# EAGLE design drive (EAGLE 9.1.3)
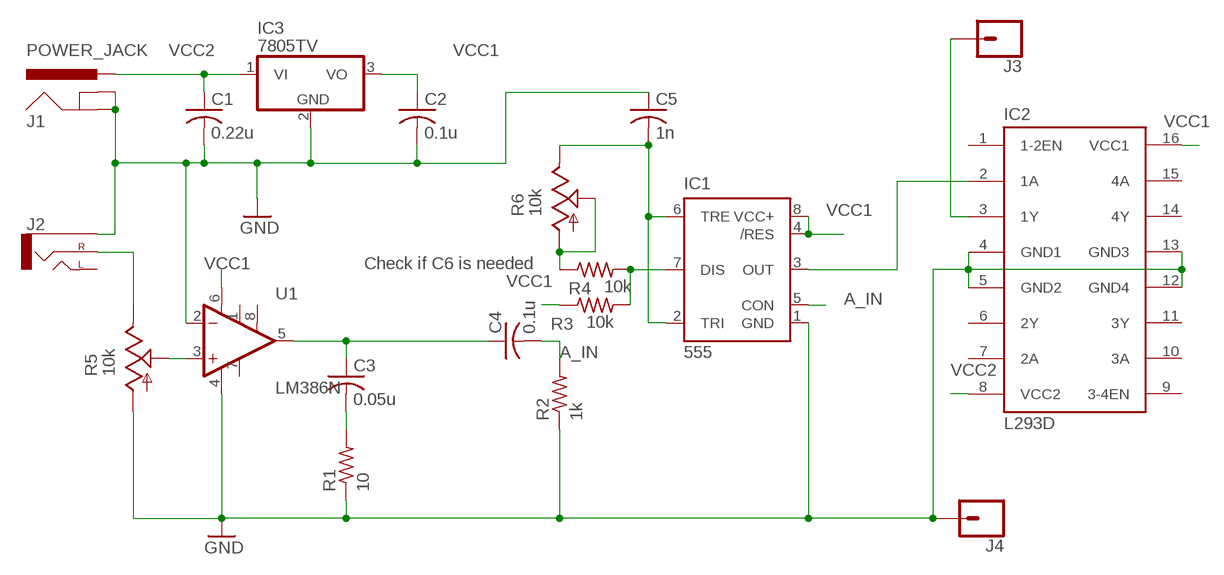
[diagram p0: schematic, sheet 1]

## Parts
C1  0.22u  C-US025-030X050  [C025-030X050]
C2  0.1u  C-US025-030X050  [C025-030X050]
C3  0.05u  C-US025-030X050  [C025-030X050]
C4  0.1u  C-US025-030X050  [C025-030X050]
C5  1n  C-US025-030X050  [C025-030X050]
IC1  555  555P  [DIP08]
IC2  L293D  [DIL16]
IC3  7805TV  [TO220V]
J1  POWER_JACK  [POWER_JACK_PTH]
J2  AUDIO_JACK_2.5MMSPECIAL_POGO_PINS  [STEREOJACK2.5MM_SPECIAL_POGOPINS]
J3  CONN_01SMTSO-256-ET-0.165DIA  [SMTSO-256-ET-0.165DIA]
J4  CONN_01SMTSO-256-ET-0.165DIA  [SMTSO-256-ET-0.165DIA]
R1  10  R-US_0207/10  [0207/10]
R2  1k  R-US_0207/10  [0207/10]
R3  10k  R-US_0207/10  [0207/10]
R4  10k  R-US_0207/10  [0207/10]
R5  10k  TRIM_US-CA6V  [CA6V]
R6  10k  TRIM_US-CA6V  [CA6V]
U1  LM386N  LM386  [DIP08]

## Nets
A_IN: C4.2 IC1.5(CON) R2.2
GND: C1.2 C2.2 C5.1 IC1.1(GND) IC2.4(GND1) IC2.5(GND2) IC2.12(GND4) IC2.13(GND3) IC3.2(GND) J1.GND J1.GNDBREAK J2.RING1(SLEEVE) J4.P$1 R1.1 R2.1 R5.A U1.2(-IN) U1.4(V-)
N$2: J2.TIP(RIGHT) R5.E
N$3: IC1.7(DIS) R3.2 R4.2
N$4: R5.S U1.3(+IN)
N$5: C3.1 C4.1 U1.5(OUT)
N$6: C3.2 R1.2
N$7: C5.2 IC1.2(TRI) IC1.6(TRE) R6.E
N$8: IC1.3(OUT) IC2.2(1A)
N$9: R4.1 R6.A R6.S
N$10: IC2.3(1Y) J3.P$1
VCC1: C2.1 IC1.4(/RES) IC1.8(VCC+) IC2.16(VCC1) IC3.3(VO) R3.1 U1.6(V+)
VCC2: C1.1 IC2.8(VCC2) IC3.1(VI) J1.PWR
Unconnected: IC2.1(1-2EN) IC2.6(2Y) IC2.7(2A) IC2.9(3-4EN) IC2.10(3A) IC2.11(3Y) IC2.14(4Y) IC2.15(4A) J2.SHIELD(LEFT) U1.1(GAIN) U1.7(BP) U1.8(GAIN)

## Notes on the sheet
- Check if C6 is needed

## Library data of the parts
C1-C5 = resistor:C-US: CAPACITOR, American symbol
IC1 = SparkFun-IC-Special-Function:555: General purpose bipolar Timer Datasheet <http://www.sparkfun.com/datasheets/Components/General/ne555.pdf> SparkFun Products SparkFun SparkPunk Sequencer Kit <https://www.sparkfun.com/products/12707> (KIT-12707) Storefront Component: 555 Timer <https://www.sparkfun.com/products/9273> (COM-09273) Two parts valid for production: VFP: IC-11930 (M7555 PTH) VFP: IC-09173 (555 PTH) - Preferred; PROD_ID: IC-09173; PROD_ID_ALT: IC-09173
IC2 = st-microelectronics:L293D: PUSH-PULL 4 CHANNEL DRIVER; MPN: L293D; OC_FARNELL: 9589619; OC_NEWARK: 56P8249
IC3 = linear:78*: Positive VOLTAGE REGULATOR Source: http://cache.national.com/ds/LM/LM78L05.pdf http://www.fairchildsemi.com/ds/LM/LM7805.pdf
J1 = SparkFun-Connectors:POWER_JACK: Power Jack Connector This is the standard 5.5mm barrel jack for power. The PTH is the most common, proven, reliable, footprint. The Slot footprint only works if the mill layer is transmitted to the PCB fab house so be warned. Here are the connectors we sell at SparkFun: DC Barrel Power Jack/Connector <https://www.sparkfun.com/products/119> (PRT-00119) DC Barrel Power Jack/Connector (SMD) <https://www.sparkfun.com/products/12748> (PRT-12748) DC Barrel Jack Adapter - Breadboard Compatible <https://www.sparkfun.com/products/10811> (PRT-10811) It is used on this SparkFun product (and many, many others): SparkFun RedBoard - Programmed with Arduino <https://www.sparkfun.com/products/12757> (DEV-12757) Also, if you need a mating power supply or connector, please check these out: Wall Adapter Power Supply - 9VDC 650mA <https://www.sparkfun.com/products/298> (TOL-00298) DC Barrel Jack Adapter - Male <https://www.sparkfun.com/products/10287> (PRT-10287); PROD_ID: CONN-08197
J2 = SparkFun-Connectors:AUDIO_JACK_2.5MM: Audio Jack 2.5mm variants of PTH and SMT audio jacks. SparkFun Products: SparkFun PicoBoard <https://www.sparkfun.com/products/11888>- 2.5mm SMD
J3 J4 = SparkFun-Connectors:CONN_01: Single connection point. Often used as Generic Header-pin footprint for 0.1 inch spaced/style header connections On any of the 0.1 inch spaced packages, you can populate with these: Break Away Headers - Straight <https://www.sparkfun.com/products/116> (PRT-00116) Break Away Male Headers - Right Angle <https://www.sparkfun.com/products/553> (PRT-00553) Female Headers <https://www.sparkfun.com/products/115> (PRT-00115) Break Away Headers - Machine Pin <https://www.sparkfun.com/products/117> (PRT-00117) Break Away Female Headers - Swiss Machine Pin <https://www.sparkfun.com/products/743> (PRT-00743) This device is also useful as a general connection point to wire up your design to another part of your project. Our various solder wires solder well into these plated through hole pads. Hook-Up Wire - Assortment (Stranded, 22 AWG) <https://www.sparkfun.com/products/11375> (PRT-11375) Hook-Up Wire - Assortment (Solid Core, 22 AWG) <https://www.sparkfun.com/products/11367> (PRT-11367) View the entire wire category on our website here <https://www.sparkfun.com/categories/141> Special notes: SMTSO-256-ET is a "flush mount" nut for a 4-40 screw. We mostly use this on specialty testbeds; it is a nice way to connect hardware to your PCB at an adjustable hieght. Also note, the SNAP packages are for using a snappable style connector. We sell a baggie of snaps and they are also used on two LilyPad designs: Snap Assortment - 30 pack (male and female) <https://www.sparkfun.com/products/11347> (DEV-11347) LilyPad Arduino SimpleSnap <https://www.sparkfun.com/products/10941> (DEV-10941) LilyPad SimpleSnap Protoboard <https://www.sparkfun.com/products/10940> (DEV-10940); PROD_ID: HW-08694
R1-R4 = resistor:R-US_: RESISTOR, American symbol
R5 R6 = pot:TRIM_US-: POTENTIOMETER
U1 = SparkFun-IC-Amplifiers:LM386: low voltage audio power amplifier SparkFun Products FabFM Radio Kit <https://www.sparkfun.com/products/11043> (KIT-11043); PROD_ID: IC-10899

## Board
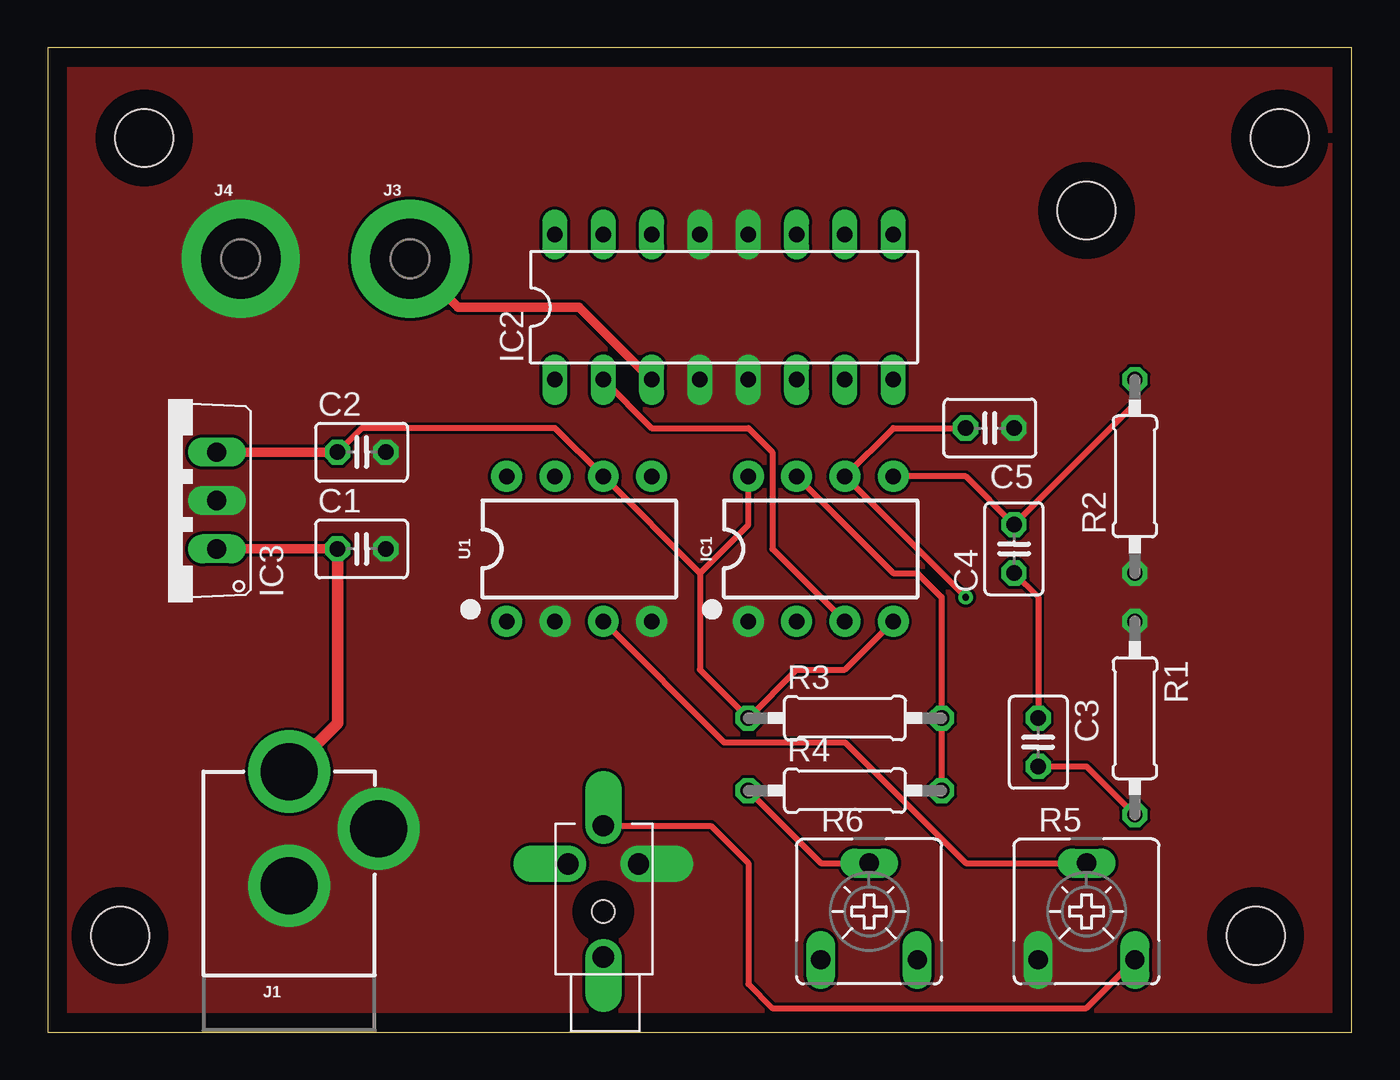
[diagram p1: board, top side]
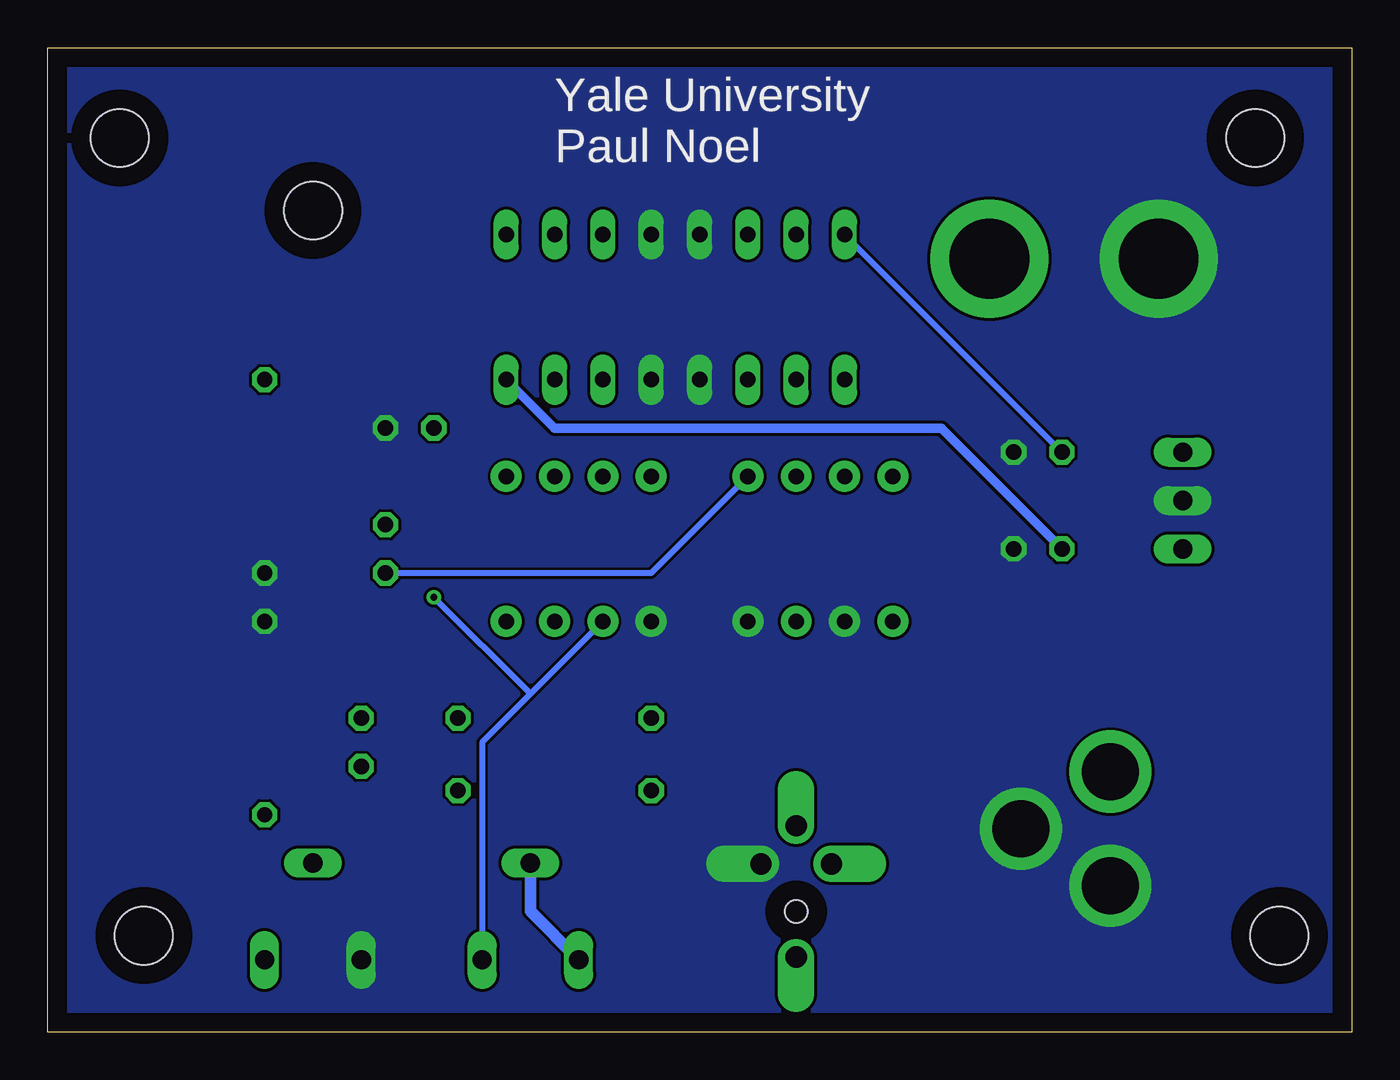
[diagram p2: board, bottom side, seen from below]

Size 68.56 x 51.74 mm. Coordinates in mm from the lower left corner, seen from the top.
Outline: 0,0 68.56,0 68.56,51.74 0,51.74 0,0
Copper layers (1*16): Top 0.035mm / dielectric 1.5mm / Bottom 0.035mm
Design rules "default": minimum track width 6mil, minimum drill 0.35mm, track to track 6mil, track to pad 6mil, pad to pad 6mil, via to via 6mil, smd to smd 6mil, copper to edge 40mil, drill to drill 6mil, minimum pad ring 10mil, minimum via ring 8mil, stop-mask expansion 4mil, vias tented up to drill 0mil, thermal gap 10mil
Holes 3.05 mm at 5.08,46.99 64.77,46.99 63.5,5.08 3.81,5.08 54.61,43.18

### Footprints (pad centres in the part's own frame; a part is rotated, then mirrored left to right if it is on the bottom)
C025-030X050 = drill 0.813 octagon: 1 -1.27,0; 2 1.27,0
DIP08 = drill 0.813 pad 1.626: 1 -3.81,-3.81; 2 -1.27,-3.81; 3 1.27,-3.81; 4 3.81,-3.81; 5 3.81,3.81; 6 1.27,3.81; 7 -1.27,3.81; 8 -3.81,3.81
DIL16 = drill 0.813 long: 1 -8.89,-3.81; 2 -6.35,-3.81; 3 -3.81,-3.81; 4 -1.27,-3.81; 5 1.27,-3.81; 6 3.81,-3.81; 7 6.35,-3.81; 8 8.89,-3.81; 9 8.89,3.81; 10 6.35,3.81; 11 3.81,3.81; 12 1.27,3.81; 13 -1.27,3.81; 14 -3.81,3.81; 15 -6.35,3.81; 16 -8.89,3.81
TO220V = drill 1.016 long: 1 -2.54,-2.54; 2 0,-2.54; 3 2.54,-2.54
POWER_JACK_PTH = drill 2.997 pad 4.318: GND 0,7.7; GNDBREAK 4.7,10.7; PWR 0,13.7
STEREOJACK2.5MM_SPECIAL_POGOPINS = drill 1.118 pad 1.93 offset: RING1 2.5,-1.85; RING2 2.5,1.85; SHIELD -2.4,0; TIP 4.5,0 | hole 1.2: 0,0
SMTSO-256-ET-0.165DIA = drill 4.191 pad 6.198: P$1 0,0
0207/10 = drill 0.813 octagon: 1 -5.08,0; 2 5.08,0
CA6V = drill 1.016 long: A -2.54,-2.54; E 2.54,-2.54; S 0,2.54

### Placement (x,y rotation side)
C1  16.51,25.4 0 top
C2  16.51,30.48 0 top
C3  52.07,15.24 270 top
C4  50.8,25.4 90 top
C5  49.53,31.75 180 top
IC1  40.64,25.4 0 top
IC2  35.56,38.1 0 top
IC3  6.35,27.94 90 top
J1  12.7,0 0 top
J2  29.21,6.35 90 top
J3  19.05,40.64 0 top
J4  10.16,40.64 0 top
R1  57.15,16.51 270 top
R2  57.15,29.21 90 top
R3  41.91,16.51 0 top
R4  41.91,12.7 0 top
R5  54.61,6.35 0 top
R6  43.18,6.35 0 top
U1  27.94,25.4 0 top

### Tracks (layer width: path | path; a pad name or v marks a point on that pad's centre or on a via)
A_IN
  Top 0.305: R2.2 57.15,33.02 C4.2 48.26,29.21 IC1.5
GND
  pour Bottom (no thermals): -15.24,105.41 181.61,105.41 181.61,-20.32 -15.24,-20.32
  pour Top (no thermals): -15.24,66.04 77.47,66.04 77.47,-12.7 -15.24,-12.7
N$2
  Top 0.305: J2.TIP 34.87,10.85 36.83,8.89 36.83,2.54 38.1,1.27 54.61,1.27 R5.E
N$3
  Top 0.305: R4.2 R3.2 46.99,22.86 45.72,24.13 44.45,24.13 IC1.7
N$4
  Top 0.305: U1.3 35.56,15.24 41.91,15.24 48.26,8.89 R5.S
N$5
  Top 0.305: C4.1 52.07,22.86 C3.1
  Bottom 0.305: U1.5 36.83,24.13 C4.1
N$6
  Top 0.305: C3.2 54.61,13.97 R1.2
N$7  (via drill 0.35)
  Top 0.305: C5.2 44.45,31.75 IC1.6 v48.26,22.86
  Bottom 0.305: IC1.2 43.18,17.78 | 43.18,17.78 45.72,15.24 R6.E | v48.26,22.86 43.18,17.78
N$8
  Top 0.305: IC2.2 31.75,31.75 36.83,31.75 38.1,30.48 38.1,25.4 IC1.3
N$9
  Top 0.305: R4.1 40.64,8.89 R6.S
  Bottom 0.61: R6.A 43.18,6.35 R6.S
N$10
  Top 0.508: IC2.3 27.94,38.1 21.59,38.1 J3.P$1
VCC1
  Top 0.305: C2.1 16.51,31.75 26.67,31.75 U1.6 34.29,24.13 | 34.29,24.13 34.29,19.05 R3.1 39.37,19.05 41.91,19.05 IC1.4 | 34.29,24.13 36.83,26.67 IC1.8
  Top 0.508: IC3.3 C2.1
  Bottom 0.305: IC2.16 C2.1
VCC2
  Top 0.508: IC3.1 C1.1
  Top 0.61: J1.PWR 15.24,16.24 C1.1
  Bottom 0.508: C1.1 21.59,31.75 41.91,31.75 IC2.8

### Text on the board
bPlace: Yale University / Paul Noel